# Altium schematic sheet lab2_kondratchenko_buck_boost.SchDoc: =title_line_1 + title_line_2
size 420 x 297 mm; SheetNumber: n
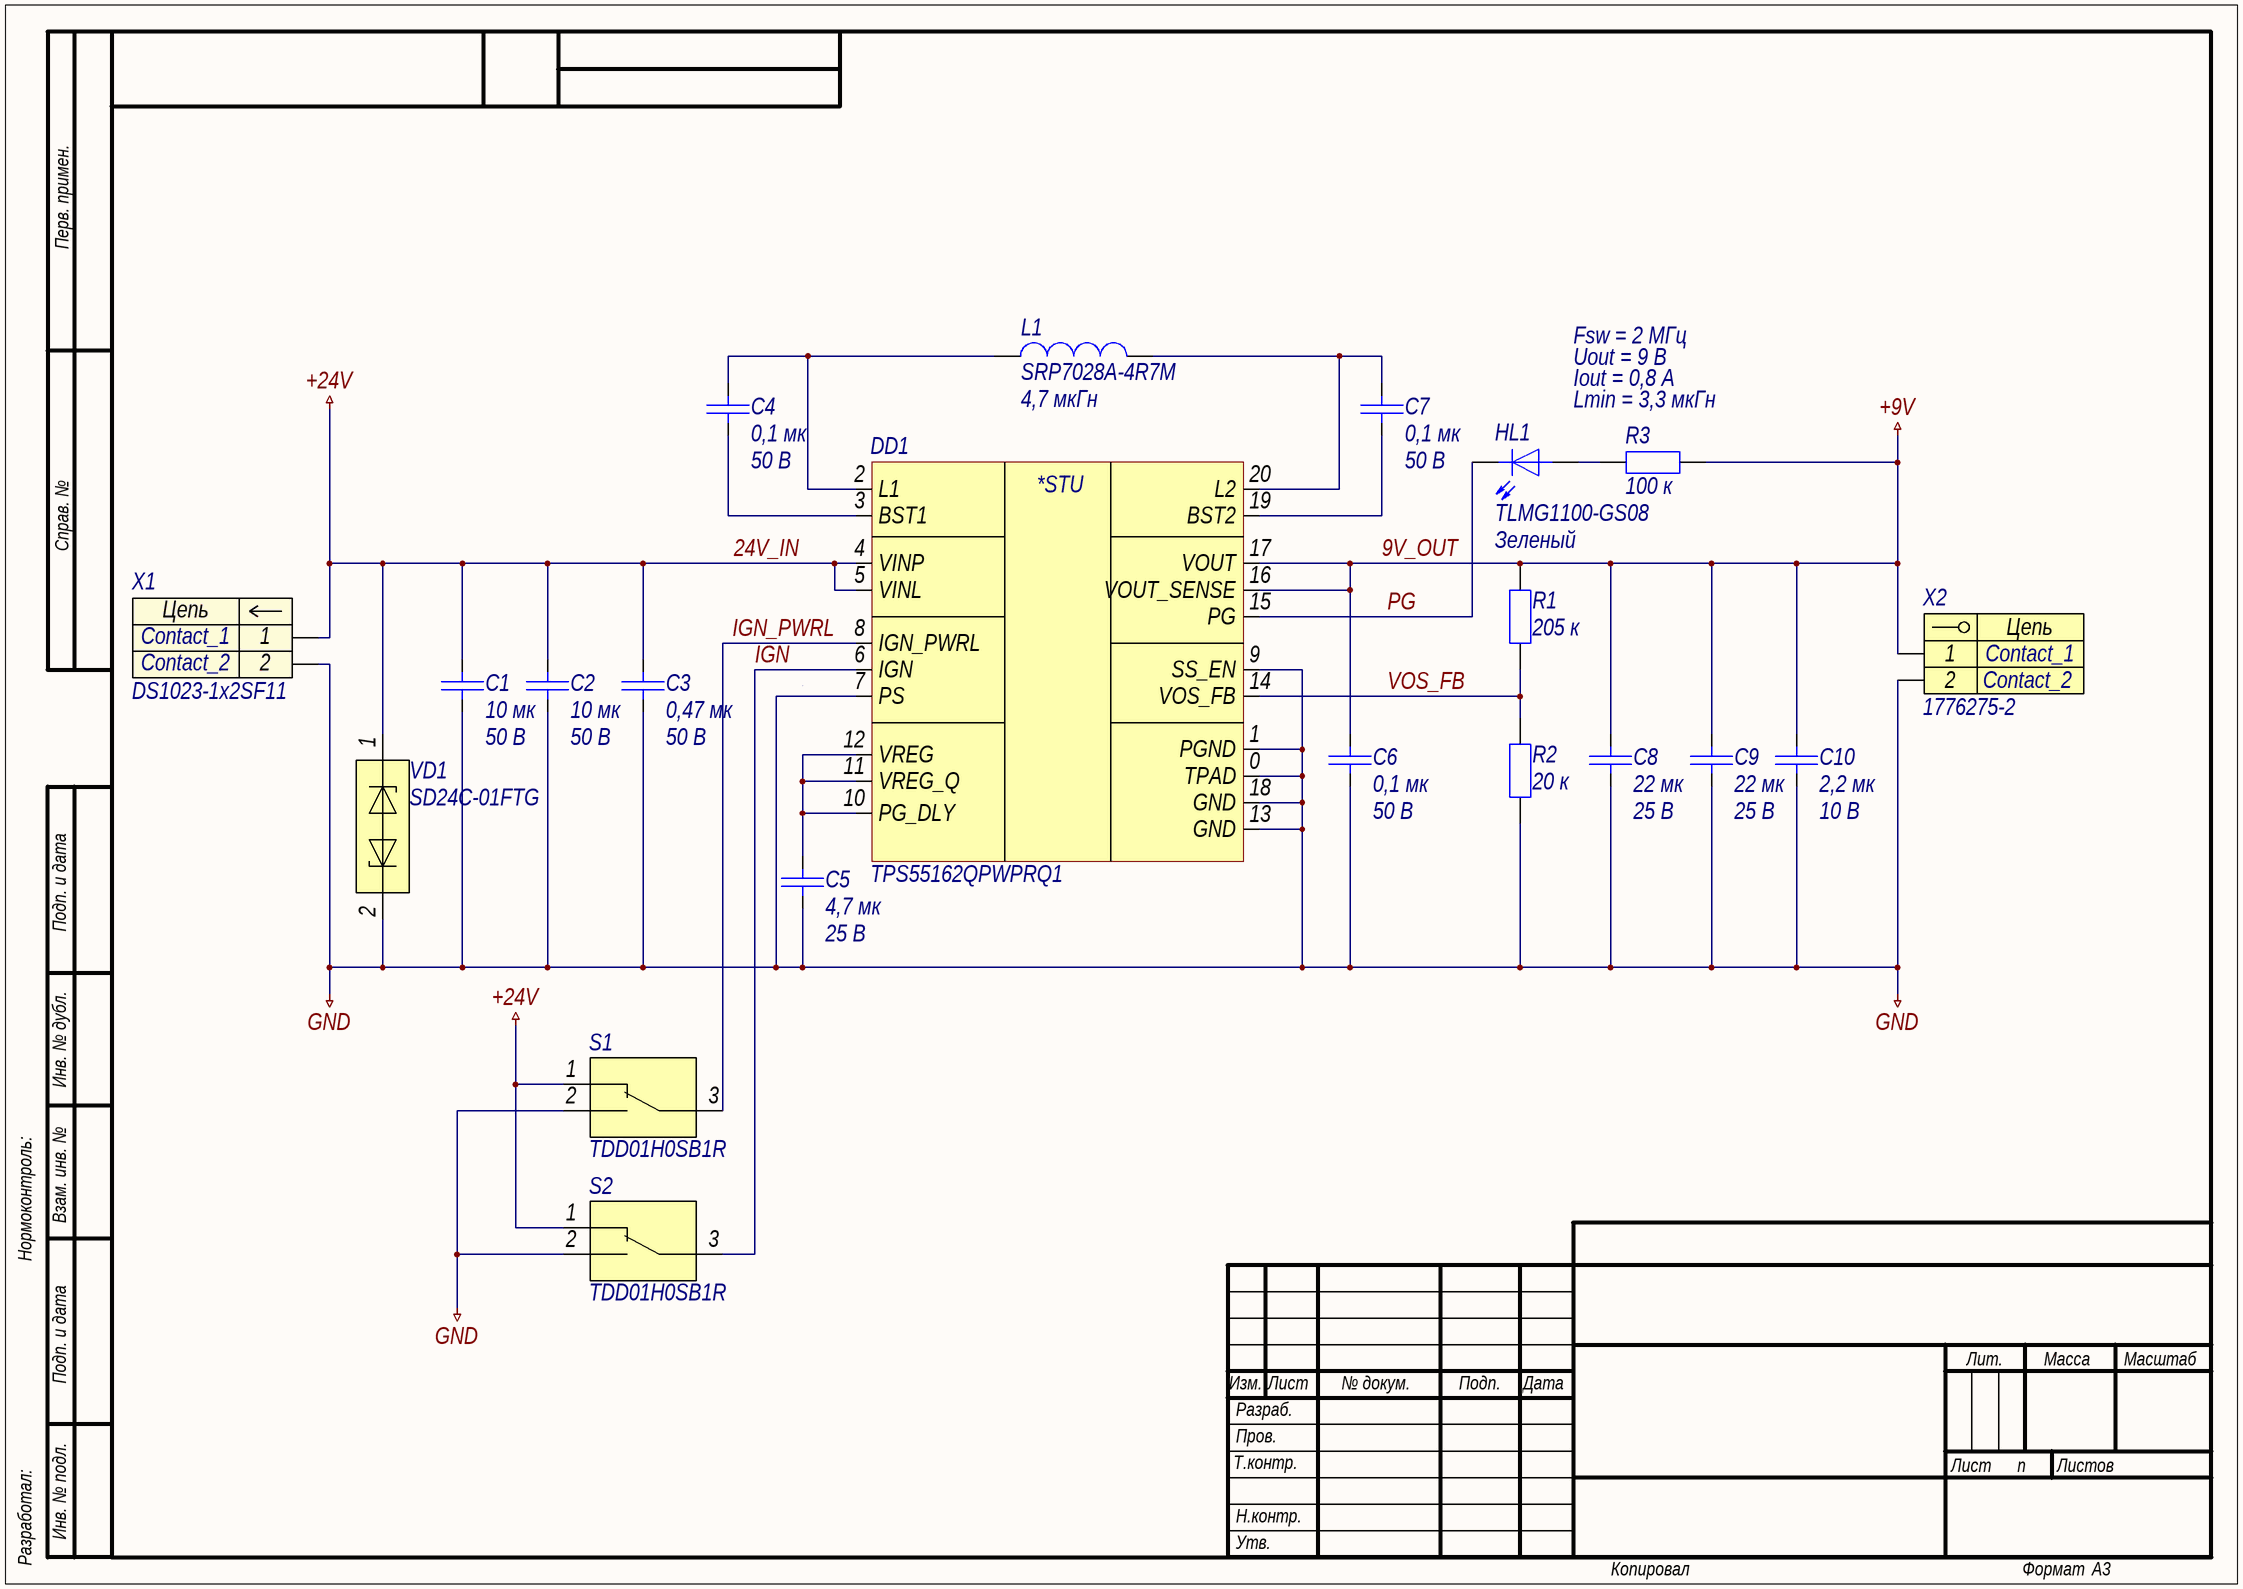
[diagram p0: lab2_kondratchenko_buck_boost.SchDoc]

## Parts
C1  10 мк  Напряжение: 50 В  [C1210]
C2  10 мк  Напряжение: 50 В  [C1210]
C3  0,47 мк  Напряжение: 50 В  [C0603]
C4  0,1 мк  Напряжение: 50 В  [C0603]
C5  4,7 мк  Напряжение: 25 В  [C0603]
C6  0,1 мк  Напряжение: 50 В  [C0603]
C7  0,1 мк  Напряжение: 50 В  [C0603]
C8  22 мк  Напряжение: 25 В  [C1210]
C9  22 мк  Напряжение: 25 В  [C1210]
C10  2,2 мк  Напряжение: 10 В  [C0603]
DD1  TPS55162QPWPRQ1  [HTSSOP-20-P65-650X440X120-L63X25-T343X275]
HL1  TLMG1100-GS08  Цвет: Зеленый  [HL0603]
L1  SRP7028A-4R7M  Индуктивность: 4,7 мкГн  [SRP-2-730X660X280]
R1  205 к  [R0603]
R2  20 к  [R0603]
R3  100 к  [R0603]
S1  TDD01H0SB1R  [TDD01H0SB1R]
S2  TDD01H0SB1R  [TDD01H0SB1R]
VD1  SD24C-01FTG  [SOD-323-257X130X114]
X1  DS1023-1x2SF11  [DS1069-2MRW6XB]
X2  1776275-2  [1776275-2]

## Nets
9V_OUT: C6.2 C8.2 C9.2 C10.2 DD1.16(VOUT_SENSE) DD1.17(VOUT) R1.1 R3.2 X2.1  [also labelled +9V]
24V_IN: C1.2 C2.2 C3.2 DD1.4(VINP) DD1.5(VINL) S1.1 S2.1 VD1.1 X1.1  [also labelled +24V]
GND: C1.1 C2.1 C3.1 C5.2 C6.1 C8.1 C9.1 C10.1 DD1.0(TPAD) DD1.1(PGND) DD1.7(PS) DD1.9(SS_EN) DD1.13(GND) DD1.18(GND) R2.1 S1.2 S2.2 VD1.2 X1.2 X2.2
IGN: DD1.6(IGN) S2.3
IGN_PWRL: DD1.8(IGN_PWRL) S1.3
PG: DD1.15(PG) HL1.1
VOS_FB: DD1.14(VOS_FB) R1.2 R2.2
NetC4_1: C4.1 DD1.3(BST1)
NetC4_2: C4.2 DD1.2(L1) L1.1
NetC5_1: C5.1 DD1.10(PG_DLY) DD1.11(VREG_Q) DD1.12(VREG)
NetC7_1: C7.1 DD1.19(BST2)
NetC7_2: C7.2 DD1.20(L2) L1.2
NetHL1_2: HL1.2 R3.1

## Notes on the sheet
- Fsw = 2 МГц
- Uout = 9 В
- Iout = 0,8 А
- Lmin = 3,3 мкГн
- Перв. примен.
- Справ. №
- Подп. и дата
- Инв. № дубл.
- Нормоконтроль:
- Взам. инв. №
- Изм.
- Лист
- № докум.
- Подп.
- Дата
- Лит.
- Масса
- Масштаб
- Т.контр.
- Пров.
- Разраб.
- Листов
- Разработал:
- Инв. № подл.
- Н.контр.
- Утв.
- Копировал
- Формат
- А3
- (in symbol dd0025) *STU
- (in symbol x0008) Цепь
- (in symbol x0039) Цепь

## Library data of the parts
C1 C2 = c0153: =Описание; ID: c0153; Фамилия: Паньков; Описание: Конденсатор керамический чип 1210 10 мкФ 50 В ±10 %; Наименование: CC1210KKX7R9BB106; Производитель: YAGEO Corp.; Отклонение: ±10 %; Рабочие температуры: от –55 °С до +125 °С; Температурный коэффициент емкости: X7R; Корпус: 1210; Номинал: 10 мк; Номинальное напряжение: 50 В; HelpURL: https://www.yageo.com/upload/media/product/productsearch/datasheet/mlcc/UPY-GPHC_X7R_6.3V-to-50V_20.pdf
C3 = c0108: =Описание; ID: c0108; Фамилия: Паньков; Описание: Конденсатор керамический чип 0603 470 нФ 50 В ±10 %; Наименование: CC0603KRX5R9BB474; Производитель: YAGEO Corp.; Отклонение: ±10 %; Рабочие температуры: от –55 °С до +85 °С; Температурный коэффициент емкости: X5R; Корпус: 0603; Номинал: 0,47 мк; Номинальное напряжение: 50 В; HelpURL: https://www.yageo.com/upload/media/product/productsearch/datasheet/mlcc/UPY-GPHC_X5R_4V-to-50V_26.pdf
C4 C6 C7 = c0087: =Описание; ID: c0087; Фамилия: Ларионов; Описание: Конденсатор керамический чип 0603 100 нФ 50 В ±5 %; Наименование: CC0603JRX7R9BB104; Производитель: YAGEO Corp.; Отклонение: ±5 %; Рабочие температуры: от –55 °С до +125 °С; Температурный коэффициент емкости: X7R; Корпус: 0603; Номинал: 0,1 мк; Номинальное напряжение: 50 В; HelpURL: https://www.yageo.com/upload/media/product/productsearch/datasheet/mlcc/UPY-GPHC_X7R_6.3V-to-50V_20.pdf
C5 = c0138: =Описание; ID: c0138; Фамилия: Ларионов; Описание: Конденсатор керамический чип 0603 4,7 мкФ 25 В ±10 %; Наименование: CC0603KRX5R8BB475; Производитель: YAGEO Corp.; Отклонение: ±10 %; Рабочие температуры: от –55 °С до +85 °С; Температурный коэффициент емкости: X5R; Корпус: 0603; Номинал: 4,7 мк; Номинальное напряжение: 25 В; HelpURL: https://www.yageo.com/upload/media/product/productsearch/datasheet/mlcc/UPY-GPHC_X5R_4V-to-50V_26.pdf
C8 C9 = c0167: =Описание; ID: c0167; Фамилия: Ляпцев; Описание: Конденсатор керамический чип 1210 22 мкФ 25 В ±10 %; Наименование: CC1210KKX7R8BB226; Производитель: YAGEO Corp.; Отклонение: ±10 %; Рабочие температуры: от –55 °С до +125 °С; Температурный коэффициент емкости: X7R; Корпус: 1210; Номинал: 22 мк; Номинальное напряжение: 25 В; HelpURL: https://www.yageo.com/upload/media/product/productsearch/datasheet/mlcc/UPY-GPHC_X7R_6.3V-to-50V_20.pdf
C10 = c0124: =Описание; ID: c0124; Фамилия: Чернов; Описание: Конденсатор керамический чип 0603 2,2 мкФ 10 В ±10 %; Наименование: CC0603KRX7R6BB225; Производитель: YAGEO Corp.; Отклонение: ±10 %; Рабочие температуры: от –55 °С до +125 °С; Температурный коэффициент емкости: X7R; Корпус: 0603; Номинал: 2,2 мк; Номинальное напряжение: 10 В; HelpURL: https://www.yageo.com/upload/media/product/productsearch/datasheet/mlcc/UPY-GPHC_X7R_6.3V-to-50V_20.pdf
DD1 = dd0025: =Описание; ID: dd0025; Фамилия: Кондратченко; Описание: Повышающий/понижающий преобразователь напряжения 3,6 .. 36 / 5,7 В / 9 В и 1,0 А; Производитель: Texas Instruments Inc.; Входное напряжение: от 3,6 В до 36 В; Выходное напряжение: от 5,7 В до 9,0 В; Коммутируемый ток: до 1,0 А; Частота переключения: 2,0 МГц; Рабочие температуры: от –40 °С до +125 °С; Корпус: HTSSOP-20; Наименование: TPS55162QPWPRQ1; HelpURL: https://www.ti.com/product/TPS55162-Q1
HL1 = hl0005: =Описание; ID: hl0005; Фамилия: Ларионов; Описание: Светодиод чип 0603 зеленый; Производитель: Vishay Intertechnology, Inc.; Номинальная сила света: 35 мкд; Номинальная длина волны: 570 нм; Номинальный прямой ток: 30 мА; Номинальное падение напряжения: 2,1 В; Рассеиваемая мощность: 90 мВт; Рабочие температуры: от –40 °С до +100 °С; Корпус: 0603; Наименование: TLMG1100-GS08; HelpURL: https://www.vishay.com/leds/list/product-83173/
L1 = l0007: =Описание; ID: l0007; Фамилия: Игнатова; Описание: Катушка индуктивности 4,7 мкГн ±20 %; Производитель: Bourns, Inc.; Отклонение: ±20 %; Номинальное активное сопротивление: 37 мОм; Максимальное активное сопротивление: 40 мОм; Резонансная частота: 21 МГц; Номинальный ток (при нагреве на 20 °С/40 °С): 5,5 А; Ток насыщения: 10 А; Рабочее напряжение: не указано; Рабочие температуры: от –55 °С до +150 °С; Корпус: 7,3 x 6,6 x 2,8; Наименование: SRP7028A-4R7M; Номинал: 4,7 мкГн; HelpURL: https://www.bourns.com/products/magnetic-products/power-inductors-aec-q200-compliant/product/SRP7028A
R1 = r0204: =Описание; ID: r0204; Фамилия: Кондратченко; Описание: Резистор чип 0603 205 кОм ±1 % 0,1 Вт; Наименование: RC0603FR-07205KL; Производитель: YAGEO Corp.; Отклонение: ±1 %; Номинальное напряжение: 75 В; Номинальный ток: 1 А; Рабочие температуры: от –55 °С до +155 °С; Корпус: 0603; Номинал: 205 к; HelpURL: https://www.yageo.com/upload/media/product/productsearch/datasheet/rchip/PYu-RC_Group_51_RoHS_L_11.pdf
R2 = r0115: =Описание; ID: r0115; Фамилия: Паньков; Описание: Резистор чип 0603 20 кОм ±1 % 0,1 Вт; Наименование: RC0603FR-0720KL; Производитель: YAGEO Corp.; Отклонение: ±1 %; Номинальное напряжение: 75 В; Номинальный ток: 1 А; Рабочие температуры: от –55 °С до +155 °С; Корпус: 0603; Примечание: Ряд E24; Номинал: 20 к; HelpURL: https://www.yageo.com/upload/media/product/productsearch/datasheet/rchip/PYu-RC_Group_51_RoHS_L_11.pdf
R3 = r0141: =Описание; ID: r0141; Фамилия: Водорезов; Описание: Резистор чип 0603 100 кОм ±1 % 0,1 Вт; Наименование: RC0603FR-07100KL; Производитель: YAGEO Corp.; Отклонение: ±1 %; Номинальное напряжение: 75 В; Номинальный ток: 1 А; Рабочие температуры: от –55 °С до +155 °С; Корпус: 0603; Примечание: Ряд E24; Номинал: 100 к; HelpURL: https://www.yageo.com/upload/media/product/productsearch/datasheet/rchip/PYu-RC_Group_51_RoHS_L_11.pdf
S1 S2 = s0008: =Описание; ID: s0008; Фамилия: Игнатова; Описание: 2-х позиционный движковый переключатель; Производитель: C&K; Ток нагрузки: 25 мА @ 24 В; Сопротивление контакта: 100 мОм; Количество контактов: 3; Рабочие температуры: от –40 °С до +85 °С; Промывка: Запрещена; Корпус: 6,00 х 4,20 х 2,30; Наименование: TDD01H0SB1R; HelpURL: https://www.ckswitches.com/products/switches/product-details/DIP/TDD/TDD01H0SB1R/
VD1 = vd0007: =Описание; ID: vd0007; Фамилия: Игнатова; Описание: Двунаправленная диодная сборка для подавления помех 24 В; Производитель: Littelfuse, Inc.; Корпус: SOD-323; Наименование: SD24C-01FTG; HelpURL: https://www.littelfuse.com/products/tvs-diode-arrays/general-purpose-esd-protection/sdc/sd24c_01ftg.aspx
X1 = x0039: =Описание; ID: x0039; Фамилия: Ларионов; Описание: CWF 2 pin Type B 2,5 мм вилка угловой; Производитель: Connfly Electronic Co., Ltd.; Contact_1: Contact_1; Contact_2: Contact_2; Наименование: DS1069-2MRW6XB; HelpURL: http://en.connfly.group/product/xVkr=EusQssAN0gN=Aos=mU+UrVkR9kqEAN0gN0MUR+g+NB+A
X2 = x0008: =Описание; ID: x0008; Фамилия: Паньков; Описание: Terminal Block 2 pin 3,5 мм; Производитель: TE Connectivity; Contact_1: Contact_1; Contact_2: Contact_2; Наименование: 1776275-2; HelpURL: https://www.te.com/usa-en/product-1776275-2.html